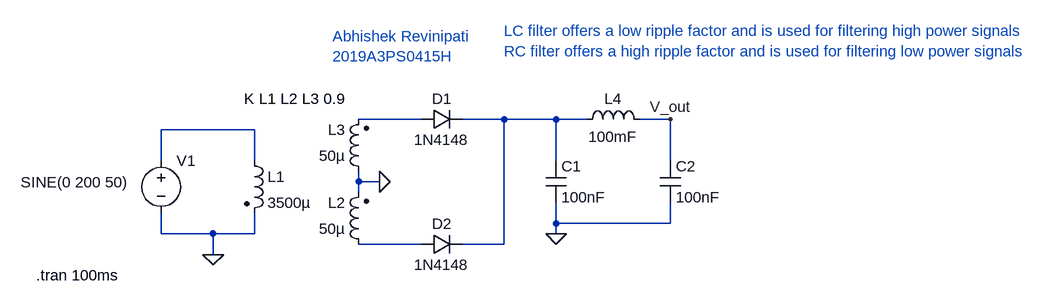
[diagram p0: schematic 2019A3PS0415H_E2_Q3.asc]
2019A3PS0415H_E2_Q3.asc, the LTspice schematic file:
Version 4
SHEET 1 1424 680
WIRE 400 32 304 32
WIRE 528 32 464 32
WIRE 608 32 528 32
WIRE 656 32 608 32
WIRE 784 32 736 32
WIRE 144 48 0 48
WIRE 0 96 0 48
WIRE 144 96 144 48
WIRE 608 96 608 32
WIRE 784 96 784 32
WIRE 304 128 304 112
WIRE 336 128 304 128
WIRE 304 144 304 128
WIRE 608 192 608 160
WIRE 784 192 784 160
WIRE 784 192 608 192
WIRE 0 208 0 176
WIRE 80 208 0 208
WIRE 144 208 144 176
WIRE 144 208 80 208
WIRE 608 208 608 192
WIRE 400 224 304 224
WIRE 528 224 528 32
WIRE 528 224 464 224
WIRE 80 240 80 208
FLAG 80 240 0
FLAG 336 128 0
FLAG 608 208 0
FLAG 784 32 V_out
SYMBOL voltage 0 80 R0
WINDOW 3 -216 49 Left 2
WINDOW 123 0 0 Left 2
SYMATTR Value SINE(0 200 50)
SYMATTR SpiceLine Rser=0.001
SYMATTR InstName V1
SYMBOL ind2 128 80 R0
SYMATTR InstName L1
SYMATTR Value 3500µ
SYMATTR Type ind
SYMBOL ind2 320 240 R180
WINDOW 0 36 80 Left 2
WINDOW 3 36 40 Left 2
SYMATTR InstName L2
SYMATTR Value 50µ
SYMATTR Type ind
SYMBOL ind2 320 128 R180
WINDOW 0 36 80 Left 2
WINDOW 3 36 40 Left 2
SYMATTR InstName L3
SYMATTR Value 50µ
SYMATTR Type ind
SYMBOL diode 400 48 R270
WINDOW 0 32 32 VTop 2
WINDOW 3 0 32 VBottom 2
SYMATTR InstName D1
SYMATTR Value 1N4148
SYMBOL diode 400 240 R270
WINDOW 0 32 32 VTop 2
WINDOW 3 0 32 VBottom 2
SYMATTR InstName D2
SYMATTR Value 1N4148
SYMBOL ind 640 48 R270
WINDOW 0 32 56 VTop 2
WINDOW 3 5 56 VBottom 2
SYMATTR InstName L4
SYMATTR Value 100mF
SYMBOL cap 592 96 R0
SYMATTR InstName C1
SYMATTR Value 100nF
SYMBOL cap 768 96 R0
SYMATTR InstName C2
SYMATTR Value 100nF
TEXT -192 272 Left 2 !.tran 100ms
TEXT 128 0 Left 2 !K L1 L2 L3 0.9
TEXT 264 -96 Left 2 ;Abhishek Revinipati\n2019A3PS0415H
TEXT 528 -104 Left 2 ;LC filter offers a low ripple factor and is used for filtering high power signals\nRC filter offers a high ripple factor and is used for filtering low power signals

The netlist it stands for:
* 2019A3PS0415H_E2_Q3.asc
V1 N003 0 SINE(0 200 50) Rser=0.001
L1 N003 0 3500µ
L2 N004 0 50µ
L3 0 N001 50µ
D1 N001 N002 1N4148
D2 N004 N002 1N4148
L4 N002 V_out 100mF
C1 N002 0 100nF
C2 V_out 0 100nF
.model D D
.lib standard.dio
.tran 100ms
K L1 L2 L3 0.9
* Abhishek Revinipati
* 2019A3PS0415H
* LC filter offers a low ripple factor and is used for filtering high power signals
* RC filter offers a high ripple factor and is used for filtering low power signals
.backanno
.end